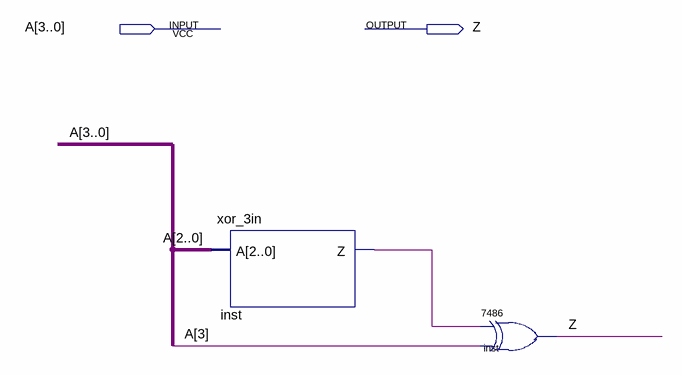
[diagram p0: schematic sheet]
// Quartus schematic xor_4in.bdf as structural Verilog: 2 symbols, 2 pins
module xor_4in (
  input  [3:0] A,
  output Z
);

  wire inst_z;

  xor_3in inst (.A(A[2:0]), .Z(inst_z));
  \7486  inst_dup2 (.\2 (inst_z), .\3 (A[3]), .\1 (Z));
endmodule
